# Altium schematic sheet Power_management.SchDoc: Power
size A3; SheetNumber: 4; SheetTotal: 10
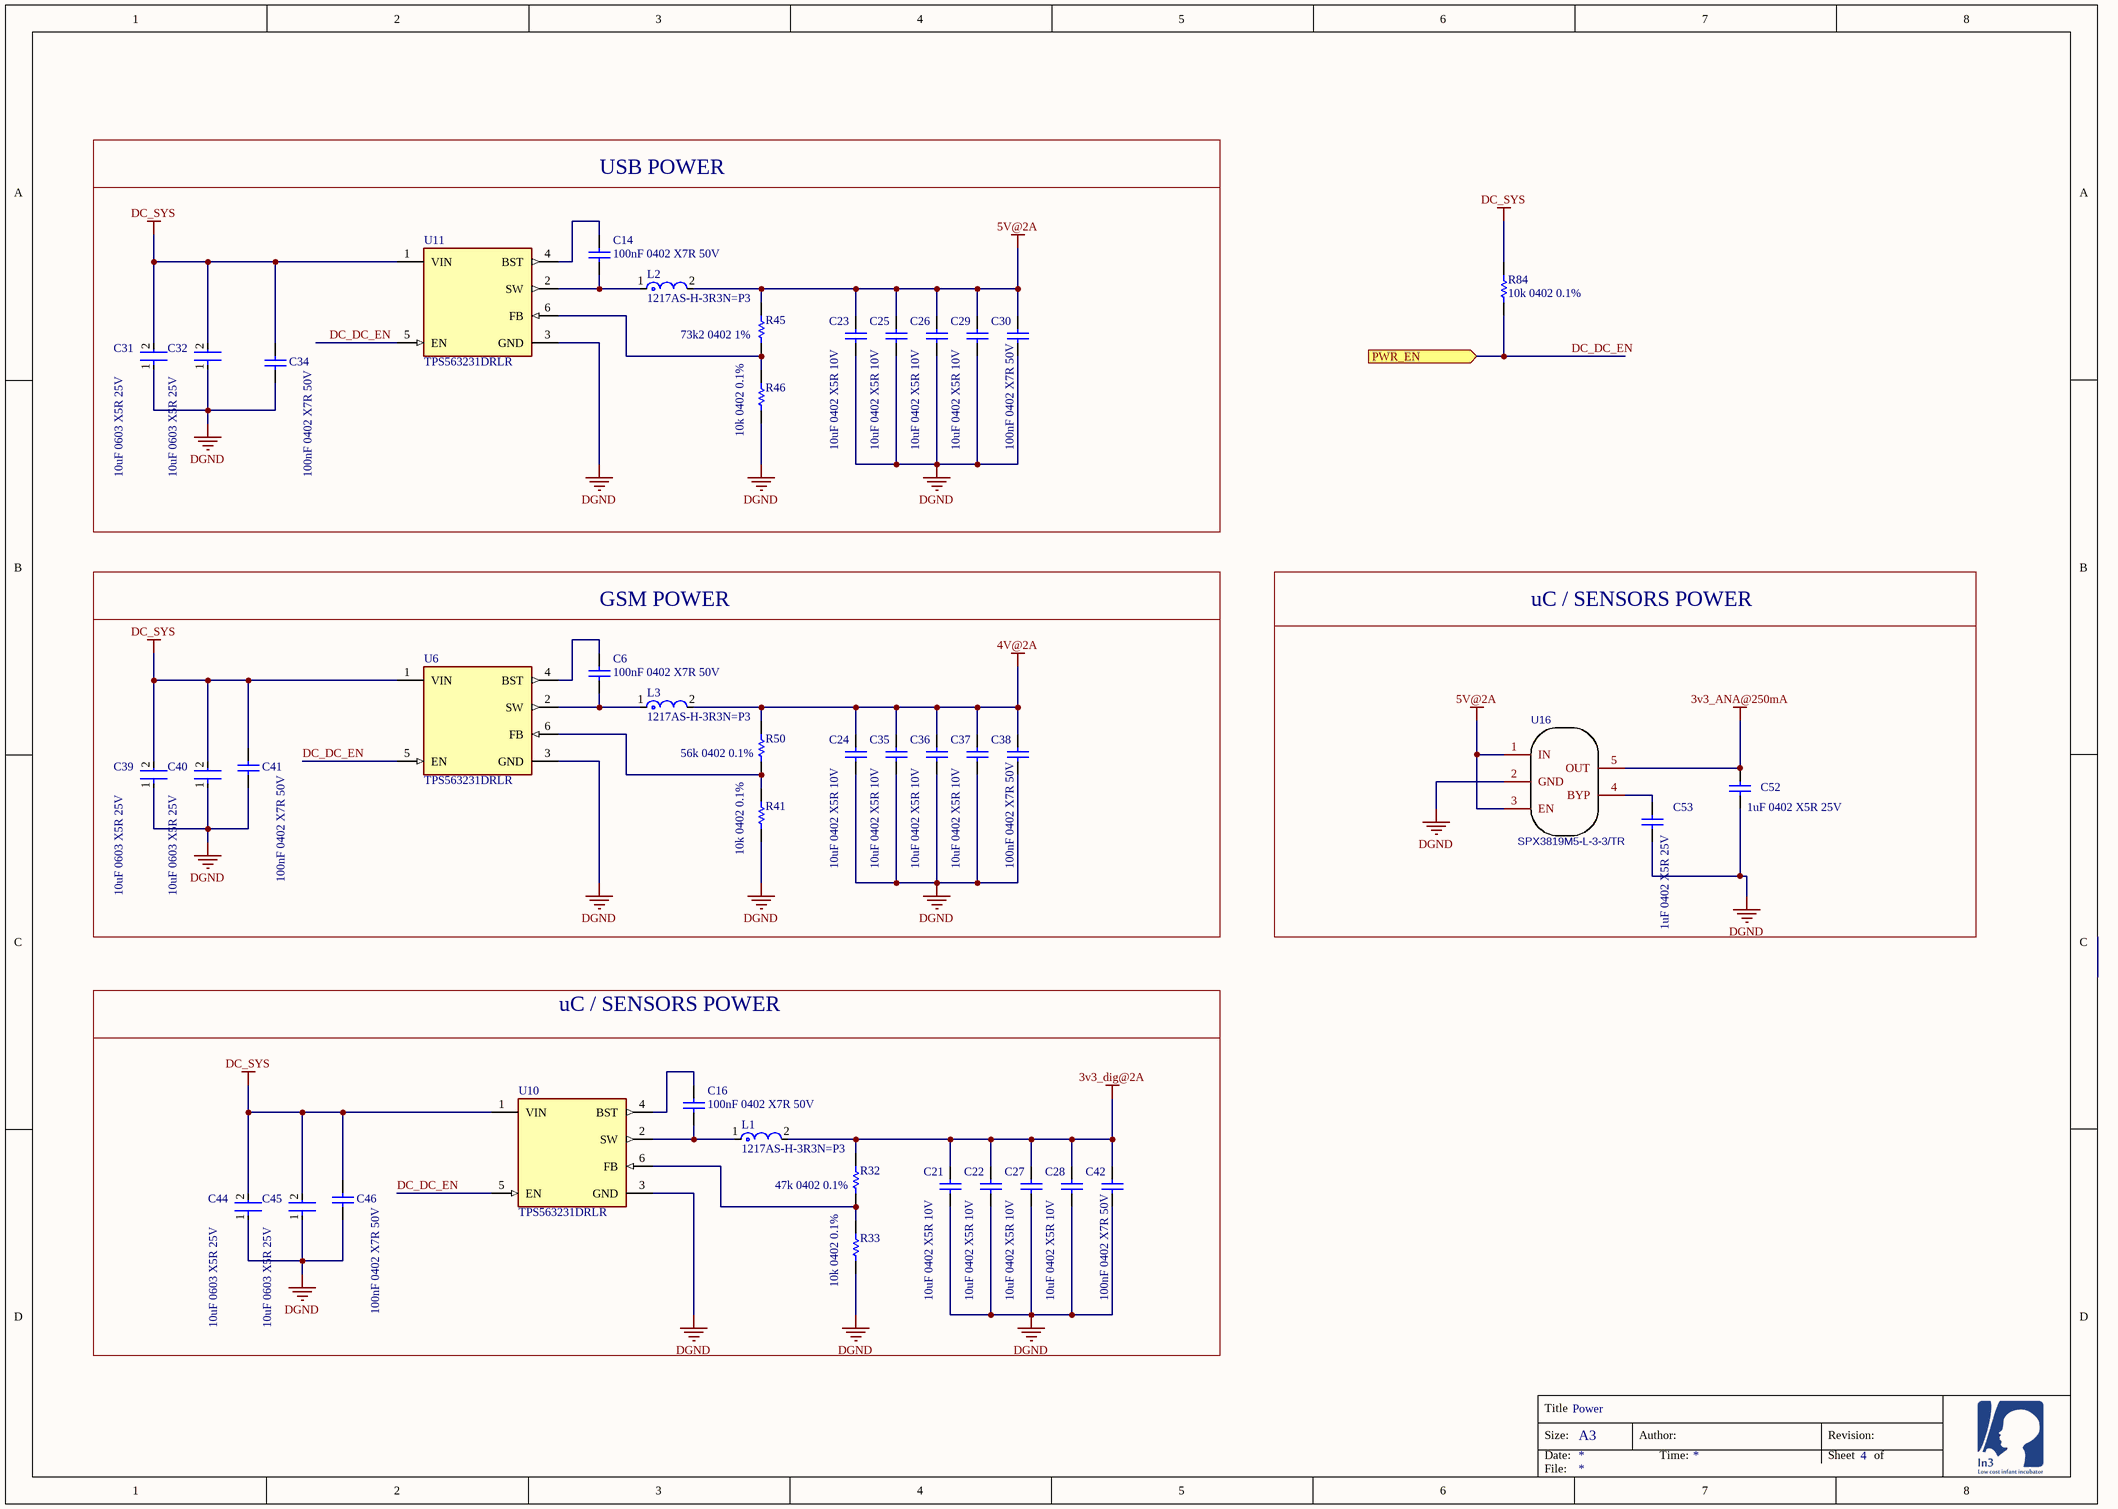
[diagram p0: Power_management.SchDoc]

## Parts
C6  100nF 0402 X7R 50V  [CAPC1005X55X25NL5T10]
C14  100nF 0402 X7R 50V  [CAPC1005X55X25NL5T10]
C16  100nF 0402 X7R 50V  [CAPC1005X55X25NL5T10]
C21  10uF 0402 X5R 10V  [CAPC1005X55X25NL5T10]
C22  10uF 0402 X5R 10V  [CAPC1005X55X25NL5T10]
C23  10uF 0402 X5R 10V  [CAPC1005X55X25NL5T10]
C24  10uF 0402 X5R 10V  [CAPC1005X55X25NL5T10]
C25  10uF 0402 X5R 10V  [CAPC1005X55X25NL5T10]
C26  10uF 0402 X5R 10V  [CAPC1005X55X25NL5T10]
C27  10uF 0402 X5R 10V  [CAPC1005X55X25NL5T10]
C28  10uF 0402 X5R 10V  [CAPC1005X55X25NL5T10]
C29  10uF 0402 X5R 10V  [CAPC1005X55X25NL5T10]
C30  100nF 0402 X7R 50V  [CAPC1005X55X25NL5T10]
C31  10uF 0603 X5R 25V  [FP-GRM188-0_2-IPC_B]
C32  10uF 0603 X5R 25V  [FP-GRM188-0_2-IPC_B]
C34  100nF 0402 X7R 50V  [CAPC1005X55X25NL5T10]
C35  10uF 0402 X5R 10V  [CAPC1005X55X25NL5T10]
C36  10uF 0402 X5R 10V  [CAPC1005X55X25NL5T10]
C37  10uF 0402 X5R 10V  [CAPC1005X55X25NL5T10]
C38  100nF 0402 X7R 50V  [CAPC1005X55X25NL5T10]
C39  10uF 0603 X5R 25V  [FP-GRM188-0_2-IPC_B]
C40  10uF 0603 X5R 25V  [FP-GRM188-0_2-IPC_B]
C41  100nF 0402 X7R 50V  [CAPC1005X55X25NL5T10]
C42  100nF 0402 X7R 50V  [CAPC1005X55X25NL5T10]
C44  10uF 0603 X5R 25V  [FP-GRM188-0_2-IPC_B]
C45  10uF 0603 X5R 25V  [FP-GRM188-0_2-IPC_B]
C46  100nF 0402 X7R 50V  [CAPC1005X55X25NL5T10]
C52  1uF 0402 X5R 25V  [CAPC1005X55X25NL5T10]
C53  1uF 0402 X5R 25V  [CAPC1005X55X25NL5T10]
L1  1217AS-H-3R3N=P3  [FP-DEM8045C-MFG]
L2  1217AS-H-3R3N=P3  [FP-DEM8045C-MFG]
L3  1217AS-H-3R3N=P3  [FP-DEM8045C-MFG]
R32  47k 0402 0.1%  [RESC1005X40X25ML05T10]
R33  10k 0402 0.1%  [RESC1005X40X25ML05T10]
R41  10k 0402 0.1%  [RESC1005X40X25ML05T10]
R45  73k2 0402 1%  [RESC1005X40X25ML05T10]
R46  10k 0402 0.1%  [RESC1005X40X25ML05T10]
R50  56k 0402 0.1%  [RESC1005X40X25ML05T10]
R84  10k 0402 0.1%  [RESC1005X40X25ML05T10]
U6  TPS563231DRLR  [FP-DRL0006A-MFG]
U10  TPS563231DRLR  [FP-DRL0006A-MFG]
U11  TPS563231DRLR  [FP-DRL0006A-MFG]
U16  SPX3819M5-L-3-3/TR  [SOT-23-5_L3.0-W1.7-P0.95-LS2.8-BR]

## Blocks framed on the sheet
USB POWER: C14 C23 C25 C26 C29-C32 C34 L2 R45 R46 U11
GSM POWER: C6 C24 C35-C41 L3 R41 R50 U6
uC / SENSORS POWER: C52 C53 U16
uC / SENSORS POWER: C16 C21 C22 C27 C28 C42 C44-C46 L1 R32 R33 U10

## Ports
PWR_EN (in)

## Nets
3v3_ANA@250mA: C52.2 U16.5(OUT)
3v3_dig@2A: C21.2 C22.2 C27.2 C28.2 C42.2 L1.2 R32.2
4V@2A: C24.2 C35.2 C36.2 C37.2 C38.2 L3.2 R50.2
5V@2A: C23.2 C25.2 C26.2 C29.2 C30.2 L2.2 R45.2 U16.1(IN) U16.3(EN)
DC_SYS: C31.2 C32.2 C34.2 C39.2 C40.2 C41.2 C44.2 C45.2 C46.2 R84.1 U6.1(VIN) U10.1(VIN) U11.1(VIN)
DGND: C21.1 C22.1 C23.1 C24.1 C25.1 C26.1 C27.1 C28.1 C29.1 C30.1 C31.1 C32.1 C34.1 C35.1 C36.1 C37.1 C38.1 C39.1 C40.1 C41.1 C42.1 C44.1 C45.1 C46.1 C52.1 C53.1 R33.1 R41.1 R46.1 U6.3(GND) U10.3(GND) U11.3(GND) U16.2(GND)
DC_DC_EN: R84.2 U6.5(EN) U10.5(EN) U11.5(EN) ; port PWR_EN
NetC6_1: C6.1 L3.1 U6.2(SW)
NetC6_2: C6.2 U6.4(BST)
NetC14_1: C14.1 L2.1 U11.2(SW)
NetC14_2: C14.2 U11.4(BST)
NetC16_1: C16.1 L1.1 U10.2(SW)
NetC16_2: C16.2 U10.4(BST)
NetC53_2: C53.2 U16.4(BYP)
NetR32_1: R32.1 R33.2 U10.6(FB)
NetR41_2: R41.2 R50.1 U6.6(FB)
NetR45_1: R45.1 R46.2 U11.6(FB)

## Notes on the sheet
- Title
- Size:
- Date:
- A3
- Author:
- Time:
- Revision:
- Sheet
- of
- File:

## Library data of the parts
C6 C14 C16 C21-C30 C34-C38 C41 C42 C46 C52 C53 = CMP-1662-00020-1: ComponentLink2Description: Datasheet; ComponentLink2URL: http://psearch.en.murata.com/capacitor/product/GRM155R60J105KE19%23.pdf; ComponentLink1Description: Manufacturer URL; ComponentLink1URL: http://www.murata.com/
  C6 C14 C16 C30 C34 C38 C41 C42 C46: LCSC_PN: C77020
  C21-C29 C35-C37: LCSC_PN: C77000
  C52 C53: LCSC_PN: C77009
C31 C32 C39 C40 C44 C45 = CMP-06035-022879-1: LCSC_PN: C91606
L1-L3 = CMP-06042-006799-1: Shielded Wirewound Inductor 3.3uH 30% 6800mA 0.0144Ω SMD; Saturation Current: 7.7A; Core Material: Ferrite; Current Rating: 6.8A; Test Frequency: 100kHz; DC Resistance (DCR): 14.4mR; Height - Seated (Max): 0.177inch; Packaging: Tape and Reel; Resistor Type: Wirewound; Tolerance: 30%; Inductance: 3.3uH; Length: 0.315inch; Number of Pins: 2; Case/Package: SMD/SMT; Mount: Surface Mount; Max DC Current: 6.8A; Width: 0.315inch; Shielding: Shielded; LCSC_PN: C514864
R32 R33 R41 R46 R50 R84 = CMP-2002-07472-1
  R32: LCSC_PN: C93943
  R33 R41 R46 R84: LCSC_PN: C190095
  R50: LCSC_PN: C114756
R45 = CMP-2002-07472-1: Manufacturer: Yageo / Phycomp; LCSC_PN: C185398
U6 U10 U11 = CMP-04918-000435-1: POWER MANAGEMENT; LCSC_PN: C779412
U16 = SPX3819M5-L-3-3/TR: BOM_Manufacturer: EXAR; BOM_Supplier: LCSC; BOM_Manufacturer Part: SPX3819M5-L-3-3/TR; BOM_Supplier Part: C9055; BOM_JLCPCB Part Class: Extended Part; spicePre: U; spiceSymbolName: SPX3819M5-L-3-3/TR; LCSC_PN: C9055